# Altium schematic sheet CPU.SchDoc
size A4
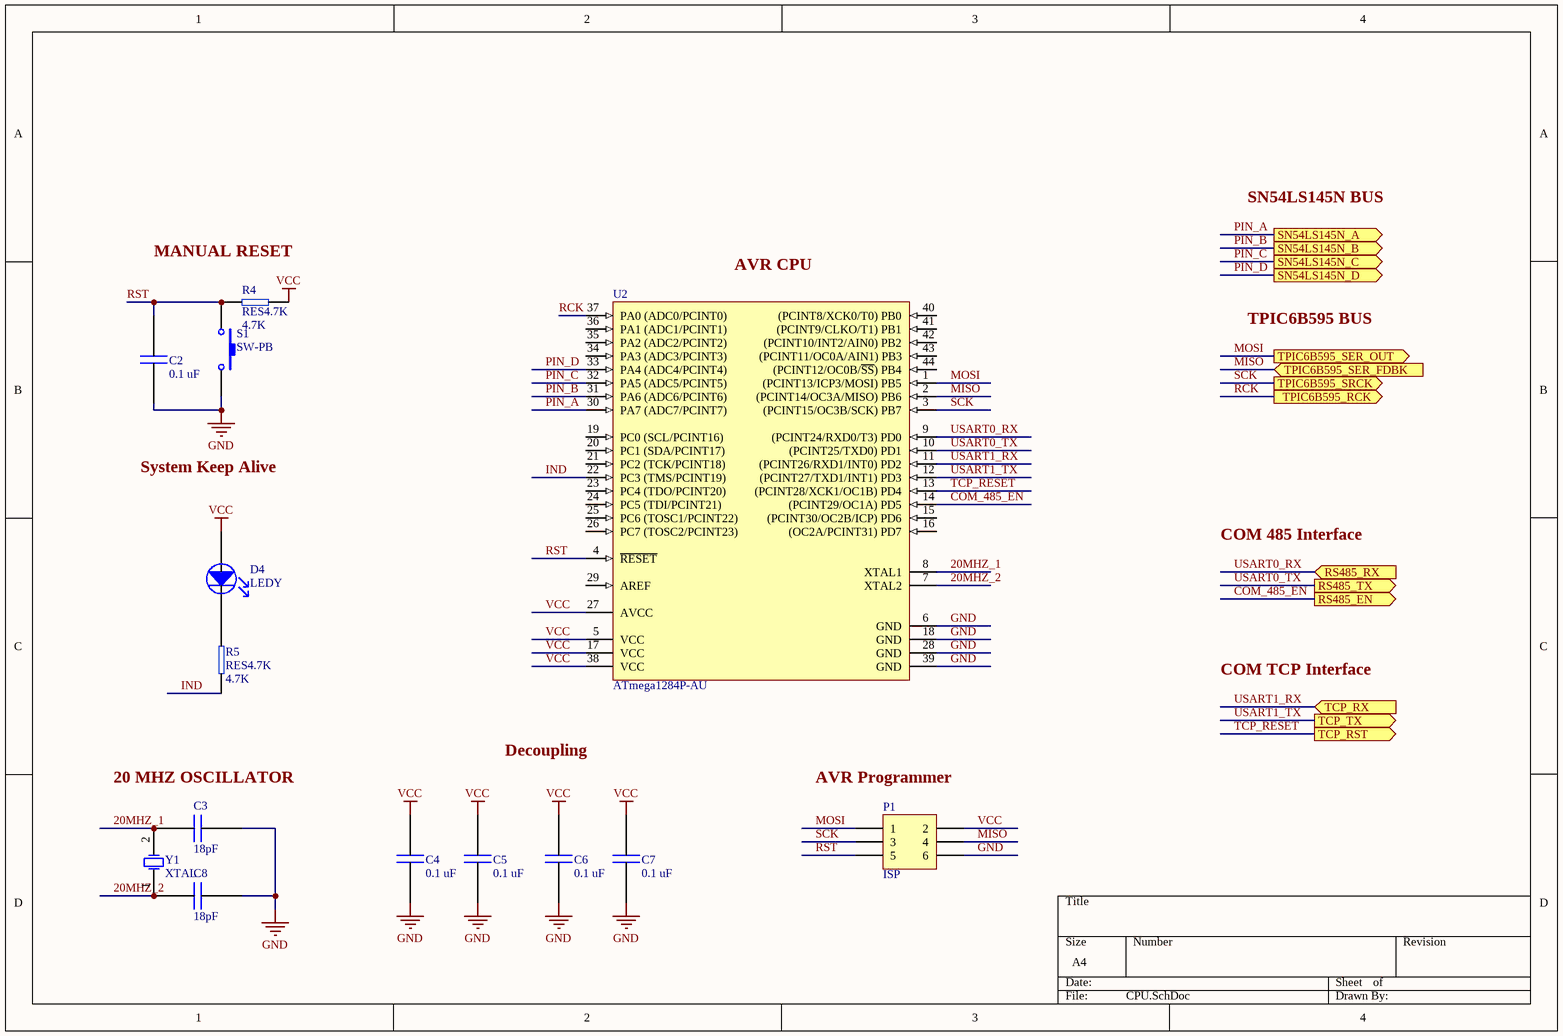
[diagram p0: CPU.SchDoc]

## Parts
C2  value 0.1 uF  [CAP0603]  (hidden comment: CAP0.1uF)
C3  value 18pF  [CAP0603]  (hidden comment: CAP18pF)
C4  value 0.1 uF  [CAP0603]  (hidden comment: CAP0.1uF)
C5  value 0.1 uF  [CAP0603]  (hidden comment: CAP0.1uF)
C6  value 0.1 uF  [CAP0603]  (hidden comment: CAP0.1uF)
C7  value 0.1 uF  [CAP0603]  (hidden comment: CAP0.1uF)
C8  value 18pF  [CAP0603]  (hidden comment: CAP18pF)
D4  LEDY  [150060YS75000]
P1  ISP  [HDR2X3]
R4  RES4.7K  value 4.7K  [RES0603]
R5  RES4.7K  value 4.7K  [RES0603]
S1  SW-PB  [microswitch]
U2  ATmega1284P-AU  [44A_N]
Y1  XTAL  [Crystal20MHz]

## Ports
RS485_EN (out), RS485_RX (in), RS485_TX (out), SN54LS145N_A (out), SN54LS145N_B (out), SN54LS145N_C (out), SN54LS145N_D (out), TCP_RST (out), TCP_RX (in), TCP_TX (out), TPIC6B595_RCK (out), TPIC6B595_SER_FDBK (in), TPIC6B595_SER_OUT (out), TPIC6B595_SRCK (out)

## Nets
GND: C2.2 C3.2 C4.2 C5.2 C6.2 C7.2 C8.2 P1.6 S1.2 U2.6(GND) U2.18(GND) U2.28(GND) U2.39(GND)
VCC: C4.1 C5.1 C6.1 C7.1 D4.2(Anode) P1.2 R4.2(neg) U2.5(VCC) U2.17(VCC) U2.27(AVCC) U2.38(VCC)
20MHZ_1: C3.1 U2.8(XTAL1) Y1.2(OSC2)
20MHZ_2: C8.1 U2.7(XTAL2) Y1.1(OSC1)
COM_485_EN: U2.14((PCINT29/OC1A)_PD5) ; port RS485_EN
IND: R5.1(pos) U2.22(PC3_(TMS/PCINT19))
MISO: P1.4 U2.2((PCINT14/OC3A/MISO)_PB6) ; port TPIC6B595_SER_FDBK
MOSI: P1.1 U2.1((PCINT13/ICP3/MOSI)_PB5) ; port TPIC6B595_SER_OUT
PIN_A: U2.30(PA7_(ADC7/PCINT7)) ; port SN54LS145N_A
PIN_B: U2.31(PA6_(ADC6/PCINT6)) ; port SN54LS145N_B
PIN_C: U2.32(PA5_(ADC5/PCINT5)) ; port SN54LS145N_C
PIN_D: U2.33(PA4_(ADC4/PCINT4)) ; port SN54LS145N_D
RCK: U2.37(PA0_(ADC0/PCINT0)) ; port TPIC6B595_RCK
RST: C2.1 P1.5 R4.1(pos) S1.1 U2.4(~{RESET})
SCK: P1.3 U2.3((PCINT15/OC3B/SCK)_PB7) ; port TPIC6B595_SRCK
TCP_RESET: U2.13((PCINT28/XCK1/OC1B)_PD4) ; port TCP_RST
USART0_RX: U2.9((PCINT24/RXD0/T3)_PD0) ; port RS485_RX
USART0_TX: U2.10((PCINT25/TXD0)_PD1) ; port RS485_TX
USART1_RX: U2.11((PCINT26/RXD1/INT0)_PD2) ; port TCP_RX
USART1_TX: U2.12((PCINT27/TXD1/INT1)_PD3) ; port TCP_TX
NetD4_1: D4.1(Cathode) R5.2(neg)

Not connected (* = marked no-connect by the designer): U2 15((PCINT30/OC2B/ICP)_PD6) 16((OC2A/PCINT31)_PD7) 19(PC0_(SCL/PCINT16)) 20(PC1_(SDA/PCINT17)) 21(PC2_(TCK/PCINT18)) 23(PC4_(TDO/PCINT20)) 24(PC5_(TDI/PCINT21)) 25(PC6_(TOSC1/PCINT22)) 26(PC7_(TOSC2/PCINT23)) 29(AREF) 34(PA3_(ADC3/PCINT3)) 35(PA2_(ADC2/PCINT2)) 36(PA1_(ADC1/PCINT1)) 40((PCINT8/XCK0/T0)_PB0) 41((PCINT9/CLKO/T1)_PB1) 42((PCINT10/INT2/AIN0)_PB2) 43((PCINT11/OC0A/AIN1)_PB3) 44((PCINT12/OC0B/~{SS})_PB4)

## Notes on the sheet
- Labels drawn without touching a wire or pin: 20 MHZ OSCILLATOR, AVR CPU, AVR Programmer, COM 485 Interface, COM TCP Interface, Decoupling, MANUAL RESET, SN54LS145N BUS, System Keep Alive, TPIC6B595 BUS

## Library data of the parts
C2 C4-C7 = C0.1UF: Capacitores cerámicos de capas múltiples (MLCC) - SMD/SMT 0603 0.1uF 16volts X7R 5%; MPN: VJ0603Y104JXJPW1BC; Supplier PN: 77-VJ0603Y104JXJPBC; Supplier: Mouser
C3 C8 = CAP18pF: Capacitores cerámicos de capas múltiples (MLCC) - SMD/SMT 0603 18pF 50volts C0G 5%; MPN: GRM1885C1H180JA01D; Supplier: Mouser; Supplier PN: 81-GRM39C180J50
D4 = LEDY: LED estándar - SMD (montaje superficial) WL-SMCW SMDMono TpVw Waterclr 0603 Yellow; Supplier: Mouser; Supplier PN: 710-150060YS75000; MPN: 150060YS75000; Value: Yellow
P1 = Header 3X2: Alojamientos de cables y cabecera 2X03P DUAL ROW; MPN: 826925-3; Value: 6 POS; Supplier: Mouser; Supplier PN: 571-826925-3
R4 R5 = RES4.7K: Resistores de película gruesa - SMD 1/10watt 4.7Kohms 1%; MPN: CRCW06034K70FKEA; Supplier PN: 71-CRCW0603-4.7K-E3; Supplier: Mouser
S1 = SW-PB: Switch; MPN: PTS635SL43SMTR LFS; Value: OFF - (ON); Supplier: Mouser; Supplier PN: 611-PTS635SL43SMTRLF
U2 = ATmega1284P-AU: 20 MHz 8-bit AVR Microcontroller with 128KB Flash, 44-Pin TQFP Pkg, Industrial Temp; Supplier: Mouser; Supplier PN: 556-ATMEGA1284P-AU; MPN: ATMEGA1284P-AU; Value: ATMEGA1284P
Y1 = XTAL: Cristales 20MHz 16pF -10C +70C; MPN: ECS-200-16-5PX-TR; Supplier: Mouser; Supplier PN: 520-ECS-200-16-5PX-T; Value: 20 MHz